# EasyEDA Pro project Main.eprj, schematic powermanagmen_2
Board Name: tof; Create Date: 2026-01-31; Page Name: powermanagmen; Project Name: Main; Schematic Name: powermanagmen_2; Update Date: 2026-01-31; File: powermanagmen; Id: /; Sheet: /
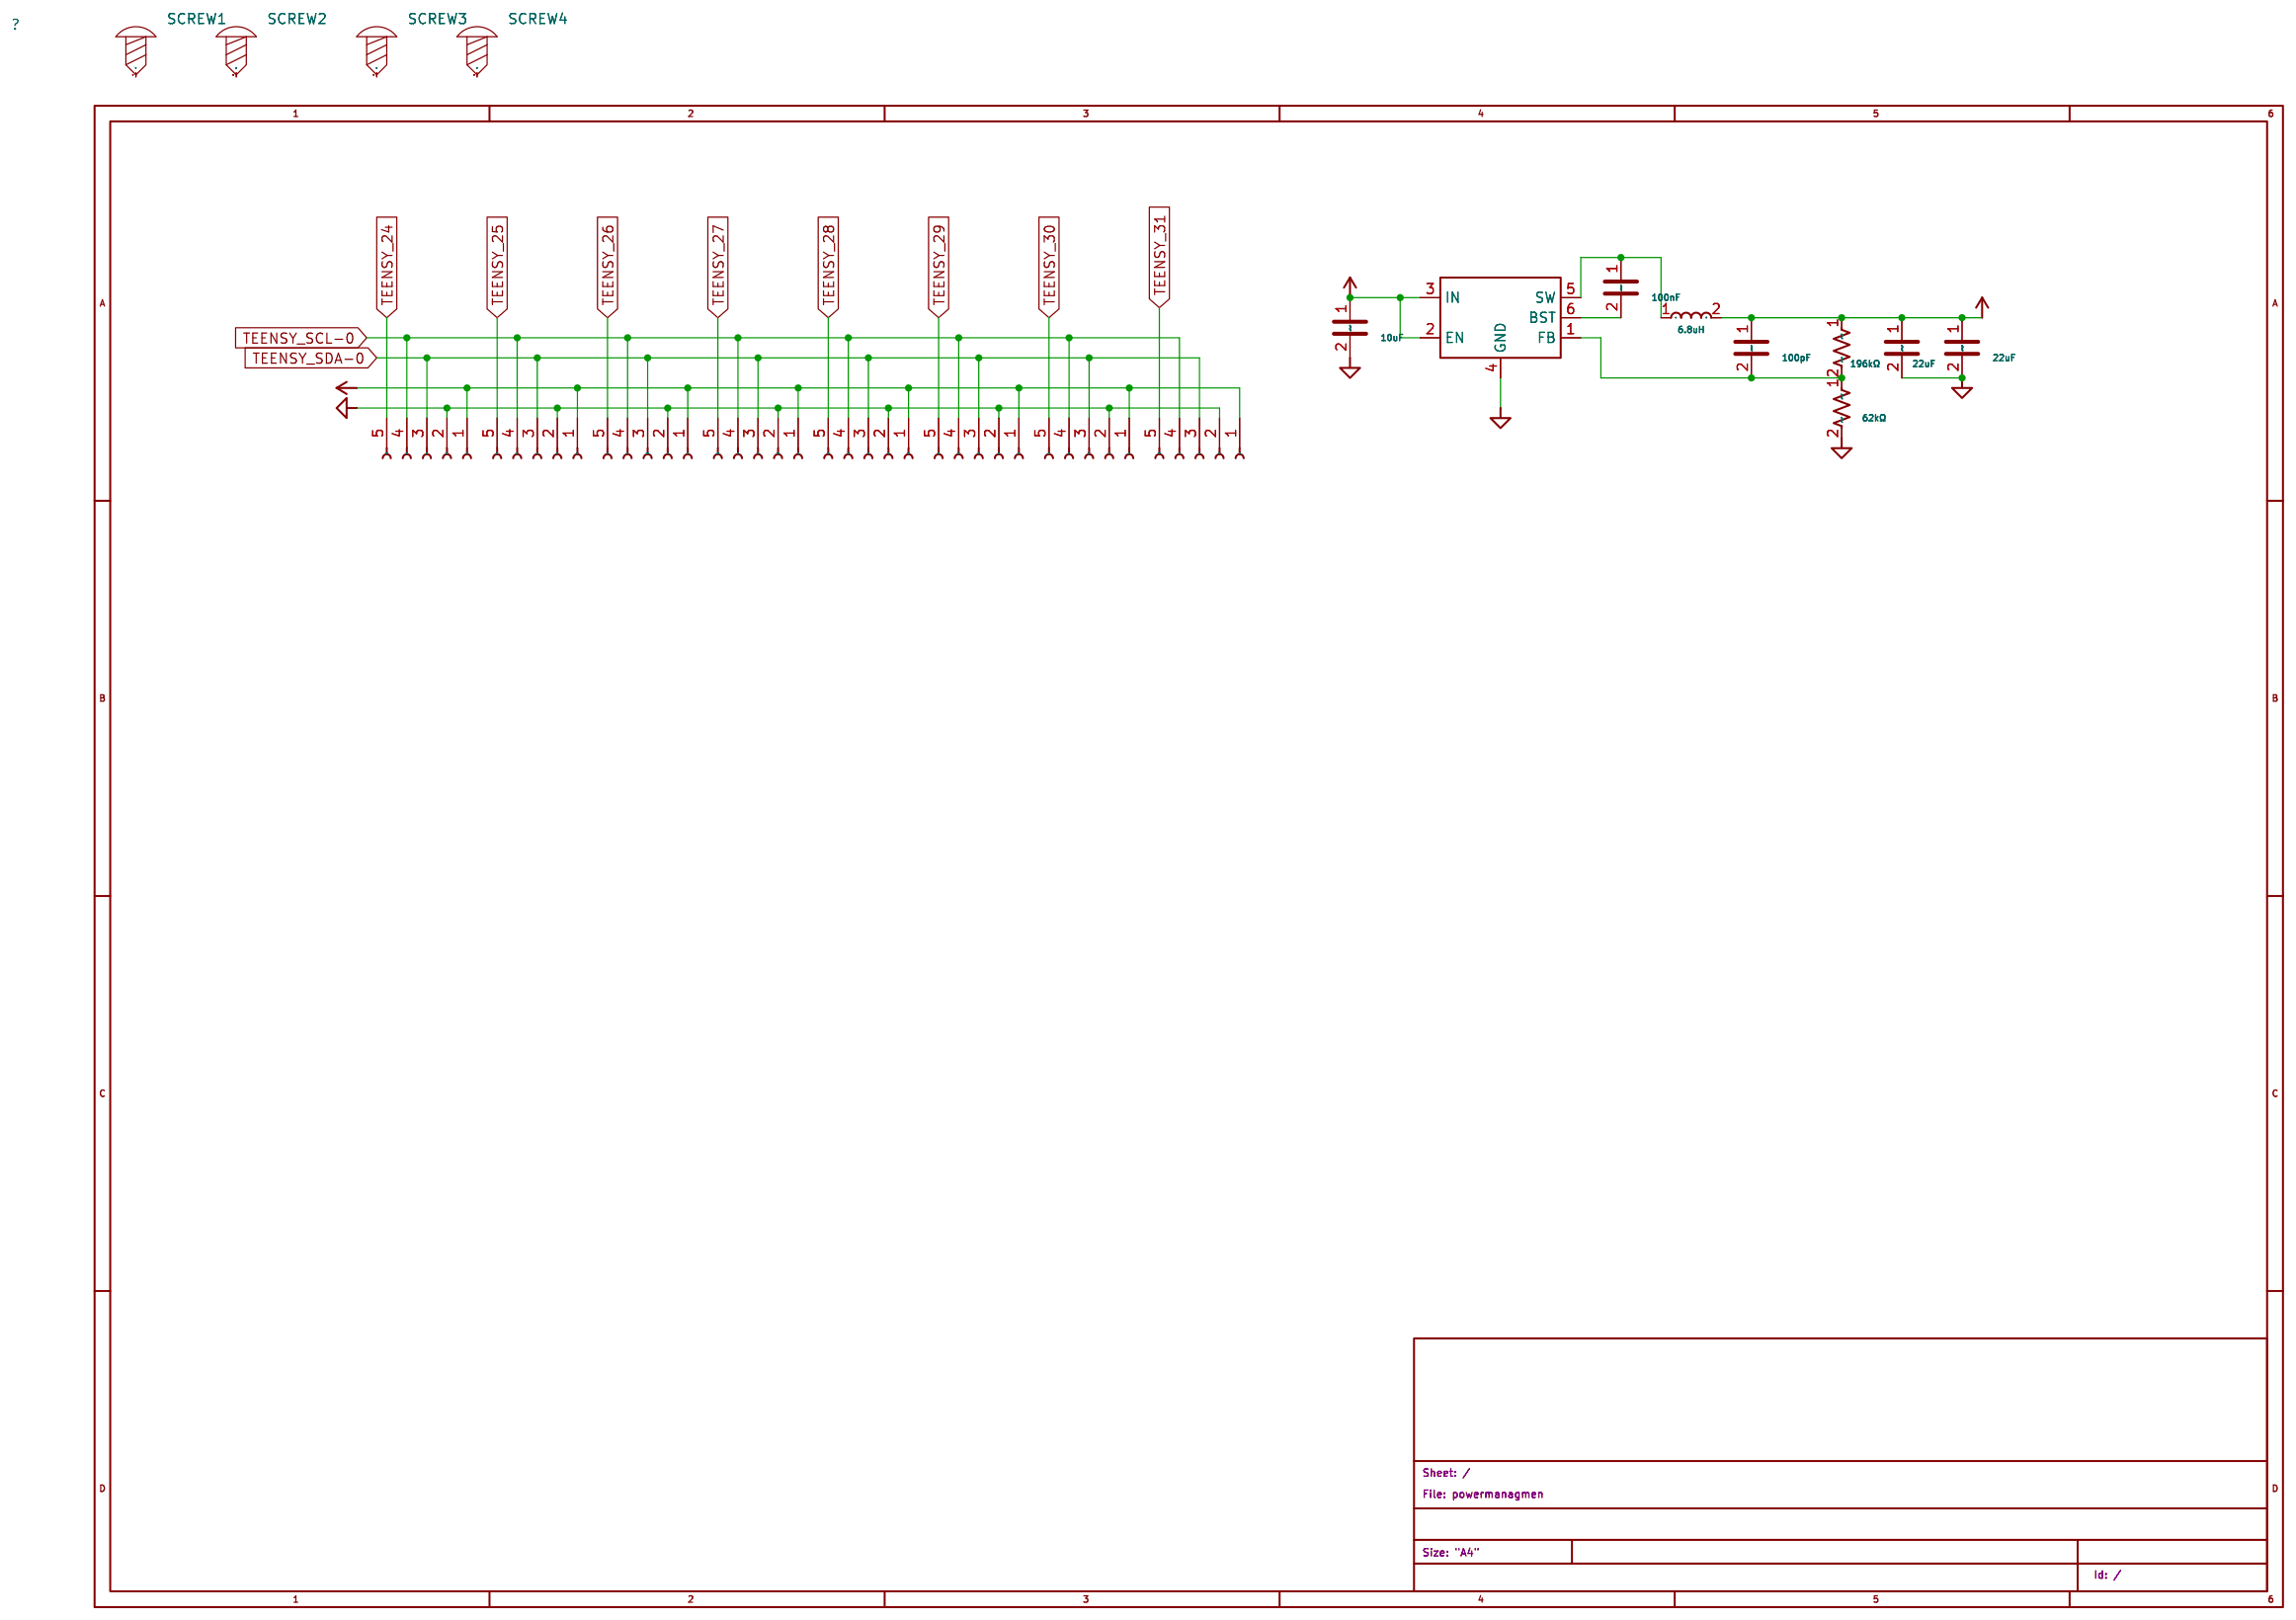
[diagram p4: schematic sheet]

## Parts
C10  100pF  [C0603]
C21  22uF  [C0603]
C23  100nF  [C0603]
C29  22uF  [C0603]
C31  10uF  [C0603]
J18  B5B-PH-K-S(LF)(SN)  [CONN-TH_B5B-PH-K-S-LF-SN]
J25  B5B-PH-K-S(LF)(SN)  [CONN-TH_B5B-PH-K-S-LF-SN]
J26  B5B-PH-K-S(LF)(SN)  [CONN-TH_B5B-PH-K-S-LF-SN]
J27  B5B-PH-K-S(LF)(SN)  [CONN-TH_B5B-PH-K-S-LF-SN]
J28  B5B-PH-K-S(LF)(SN)  [CONN-TH_B5B-PH-K-S-LF-SN]
J29  B5B-PH-K-S(LF)(SN)  [CONN-TH_B5B-PH-K-S-LF-SN]
J32  B5B-PH-K-S(LF)(SN)  [CONN-TH_B5B-PH-K-S-LF-SN]
J33  B5B-PH-K-S(LF)(SN)  [CONN-TH_B5B-PH-K-S-LF-SN]
L3  6.8uH  [L0805]
R12  196kΩ  [R0603]
R13  62kΩ  [R0603]
SCREW1  -  [Screw-Hole-M2]
SCREW2  -  [Screw-Hole-M2]
SCREW3  -  [Screw-Hole-M2]
SCREW4  -  [Screw-Hole-M2]
U4  AP63201WU-7  [TSOT-23-6_L2.9-W1.6-P0.95-LS2.8-BR]

## Library data of the parts
C10 = CL10C101JB8NNNC: Capacitance:100pF Tolerance:±5% Tolerance:±5% Voltage Rating:50V Temperature Coefficient:C0G; LCSC Part Name: 100pF ±5% 50V; Supplier Part: C14858; Manufacturer: SAMSUNG(三星); Supplier Footprint: 0603; JLCPCB Part Class: Basic Part; Datasheet: https://item.szlcsc.com/datasheet/CL10C101JB8NNNC/15530.html; Supplier: LCSC; Tolerance: ±5%; Voltage Rating: 50V; Temperature Coefficient: C0G
C21 C29 = CL10A226MP8NUNE: Capacitance:22uF Tolerance:±20% Tolerance:±20% Voltage Rating:10V Temperature Coefficient:X5R; LCSC Part Name: 22uF ±20% 10V; Supplier Part: C86295; Manufacturer: SAMSUNG(三星); Supplier Footprint: 0603; JLCPCB Part Class: Extended Part; Datasheet: https://item.szlcsc.com/datasheet/CL10A226MP8NUNE/87471.html; Supplier: LCSC; Tolerance: ±20%; Voltage Rating: 10V; Temperature Coefficient: X5R
C23 = TCC0603X7R104K500CT: Capacitance:100nF Tolerance:±10% Tolerance:±10% Voltage Rating:50V Temperature Coefficient:X7R; LCSC Part Name: 100nF ±10% 50V; Supplier Part: C282519; Manufacturer: CCTC(三环); Supplier Footprint: 0603; JLCPCB Part Class: Extended Part; Datasheet: https://item.szlcsc.com/datasheet/TCC0603X7R104K500CT/268639.html; Supplier: LCSC; Tolerance: ±10%; Voltage Rating: 50V; Temperature Coefficient: X7R
C31 = CL10A106MO8NQNC: Capacitance:10uF Tolerance:±20% Tolerance:±20% Voltage Rating:16V Temperature Coefficient:X5R; LCSC Part Name: 10uF ±20% 16V; Supplier Part: C92487; Manufacturer: SAMSUNG(三星); Supplier Footprint: 0603; JLCPCB Part Class: Extended Part; Datasheet: https://item.szlcsc.com/datasheet/CL10A106MO8NQNC/93680.html; Supplier: LCSC; Tolerance: ±20%; Voltage Rating: 16V; Temperature Coefficient: X5R
J18 J25-J29 J32 J33 = B5B-PH-K-S(LF)(SN): Pins Structure:1x5P Pitch:2mm Mounting Type:Through Hole Reference Series:PH Number of Pins:5P Number of Rows:1 Number of PINs Per Row:5 Row Spacing:- Current Rating:2A Contact Material:Brass Contact Plating:Tin Operating Temperature:-25℃~+85℃ Operating T; LCSC Part Name: 1x5P 间距:2mm 直插 系列:PH; Supplier Part: C157993; Manufacturer: JST; Supplier Footprint: 插件,P=2mm; JLCPCB Part Class: Extended Part; Datasheet: https://item.szlcsc.com/datasheet/B5B-PH-K-S(LF)(SN)/169341.html; Supplier: LCSC; Pins Structure: 1x5P; Pitch: 2mm; Mounting Type: Through Hole; Reference Series: PH; Number of Pins: 5P; Number of Rows: 1; Number of PINs Per Row: 5; Current Rating: 2A; Contact Material: Brass; Contact Plating: Tin; Operating Temperature: -25℃~+85℃; Voltage Rating: 100V; Plastic Material: PA66; Flame Retardant Rating: UL94V-0; Supplementary Features: K Pin; Color: White; Z-Height of the Board: 6mm; X-Length of Bottom Edge on Board (Spacing Line): 11.9mm; Y-Width of Bottom Edge on Board: 4.5mm
L3 = MGFL2012F6R8MT-LF: Inductance:6.8uH Tolerance:±20% Tolerance:±20% Current Rating:550mA Current - Saturation (Isat):- DC Resistance(DCR):270mΩ Q @ Frequency:- Frequency - Self Resonant:- Ratings:-; LCSC Part Name: 6.8uH ±20%; Supplier Part: C486332; Manufacturer: microgate(麦捷科技); Supplier Footprint: 0805; JLCPCB Part Class: Extended Part; Datasheet: https://item.szlcsc.com/datasheet/MGFL2012F6R8MT-LF/494805.html; Supplier: LCSC; Tolerance: ±20%; Current Rating: 550mA; DC Resistance(DCR): 270mΩ
R12 = FRC0603F1963TS: Type:Thick Film Resistor Resistance:196kΩ Tolerance:±1% Tolerance:±1% Power(Watts):100mW Voltage-Supply(Max):75V Temperature Coefficient:±100ppm/℃ Temperature Coefficient:±100ppm/℃ Operating Temperature:-55℃~+155℃ Operating Temperature:-55℃~+155℃; LCSC Part Name: 196kΩ ±1% 100mW 厚膜电阻; Supplier Part: C2974032; Manufacturer: FOJAN(富捷); Supplier Footprint: 0603; JLCPCB Part Class: Extended Part; Supplier: LCSC; Type: Thick Film Resistor; Tolerance: ±1%; Power(Watts): 100mW; Voltage-Supply(Max): 75V; Temperature Coefficient: ±100ppm/℃; Operating Temperature: -55℃~+155℃
R13 = FRC0603F6202TS: Type:Thick Film Resistor Resistance:62kΩ Tolerance:±1% Tolerance:±1% Power(Watts):100mW Voltage-Supply(Max):75V Temperature Coefficient:±100ppm/℃ Temperature Coefficient:±100ppm/℃ Operating Temperature:-55℃~+155℃ Operating Temperature:-55℃~+155℃; LCSC Part Name: 62kΩ ±1% 100mW 厚膜电阻; Supplier Part: C2907059; Manufacturer: FOJAN(富捷); Supplier Footprint: 0603; JLCPCB Part Class: Extended Part; Supplier: LCSC; Type: Thick Film Resistor; Tolerance: ±1%; Power(Watts): 100mW; Voltage-Supply(Max): 75V; Temperature Coefficient: ±100ppm/℃; Operating Temperature: -55℃~+155℃
SCREW1-SCREW4 = Screw-Hole-M2: Supplier Footprint: 插件
U4 = AP63201WU-7: Function:Buck Voltage - Supply:3.8V~32V Voltage - Supply:3.8V~32V Output Voltage:- Output Voltage:- Output Current:2A Frequency - Switching:500kHz Frequency - Switching:500kHz Operating Temperature:-40℃~+85℃ Operating Temperature:-40℃~+85℃ Synchronous Rec; LCSC Part Name: 3.8V至32V输入、2A低静态电流同步降压转换器，增强EMI抑制; Supplier Part: C2071044; Manufacturer: DIODES(美台); Supplier Footprint: TSOT-23-6; JLCPCB Part Class: Extended Part; Datasheet: https://item.szlcsc.com/datasheet/AP63201WU-7/2162627.html; Supplier: LCSC; Function: Buck; Voltage - Supply: 3.8V~32V; Output Current: 2A; Frequency - Switching: 500kHz; Operating Temperature: -40℃~+85℃; Synchronous Rectifier: Yes; Number of Outputs: 1; Topology: Buck; Quiescent Current: 22uA; Switch tube (built-in/external): Built-In; Output Type: Adjustable

## Nets
+3.3V: C10.1 C21.1 C29.1 J18.1(Pin) J25.1(Pin) J26.1(Pin) J27.1(Pin) J28.1(Pin) J29.1(Pin) J32.1(Pin) J33.1(Pin) L3.2 R12.1
+BATT: C31.1 U4.2(EN) U4.3(IN)
POWER_GND: C21.2 C29.2 C31.2 J18.2(Pin) J25.2(Pin) J26.2(Pin) J27.2(Pin) J28.2(Pin) J29.2(Pin) J32.2(Pin) J33.2(Pin) R13.2 U4.4(GND)
TEENSY_24: J25.5(Pin)
TEENSY_25: J18.5(Pin)
TEENSY_26: J26.5(Pin)
TEENSY_27: J27.5(Pin)
TEENSY_28: J28.5(Pin)
TEENSY_29: J29.5(Pin)
TEENSY_30: J32.5(Pin)
TEENSY_31: J33.5(Pin)
TEENSY_SCL-0: J18.4(Pin) J25.4(Pin) J26.4(Pin) J27.4(Pin) J28.4(Pin) J29.4(Pin) J32.4(Pin) J33.4(Pin)
TEENSY_SDA-0: J18.3(Pin) J25.3(Pin) J26.3(Pin) J27.3(Pin) J28.3(Pin) J29.3(Pin) J32.3(Pin) J33.3(Pin)
$1N12: C10.2 R12.2 R13.1 U4.1(FB)
$1N29: C23.1 L3.1 U4.5(SW)
$1N113: C23.2 U4.6(BST)

Not connected (* = marked no-connect by the designer): SCREW1 1; SCREW2 1; SCREW3 1; SCREW4 1
